# Altium schematic sheet OpenPLCv0.2.0_AnalogueOutput.SchDoc
size 420 x 297 mm; PageSetup: Record=PageOptions|CenterHorizontal=True|CenterVertical=True|PrintScale=1.01|XCorrection=1.00|YCorrection=1.00|PrintKind=1|BorderSize=5000000|LeftOffset=0|BottomOffset=0|Orientation=2|PaperLength=1000|PaperWidth=1000|Scale=100|PaperSource=7|PrintQuality=-4|MediaType=1|DitherType=10|PaperKind=A3|PrintScaleMode=1; DocumentNumber: 4; SheetNumber: 4; SheetTotal: 22; SheetTitle: Analogue Output
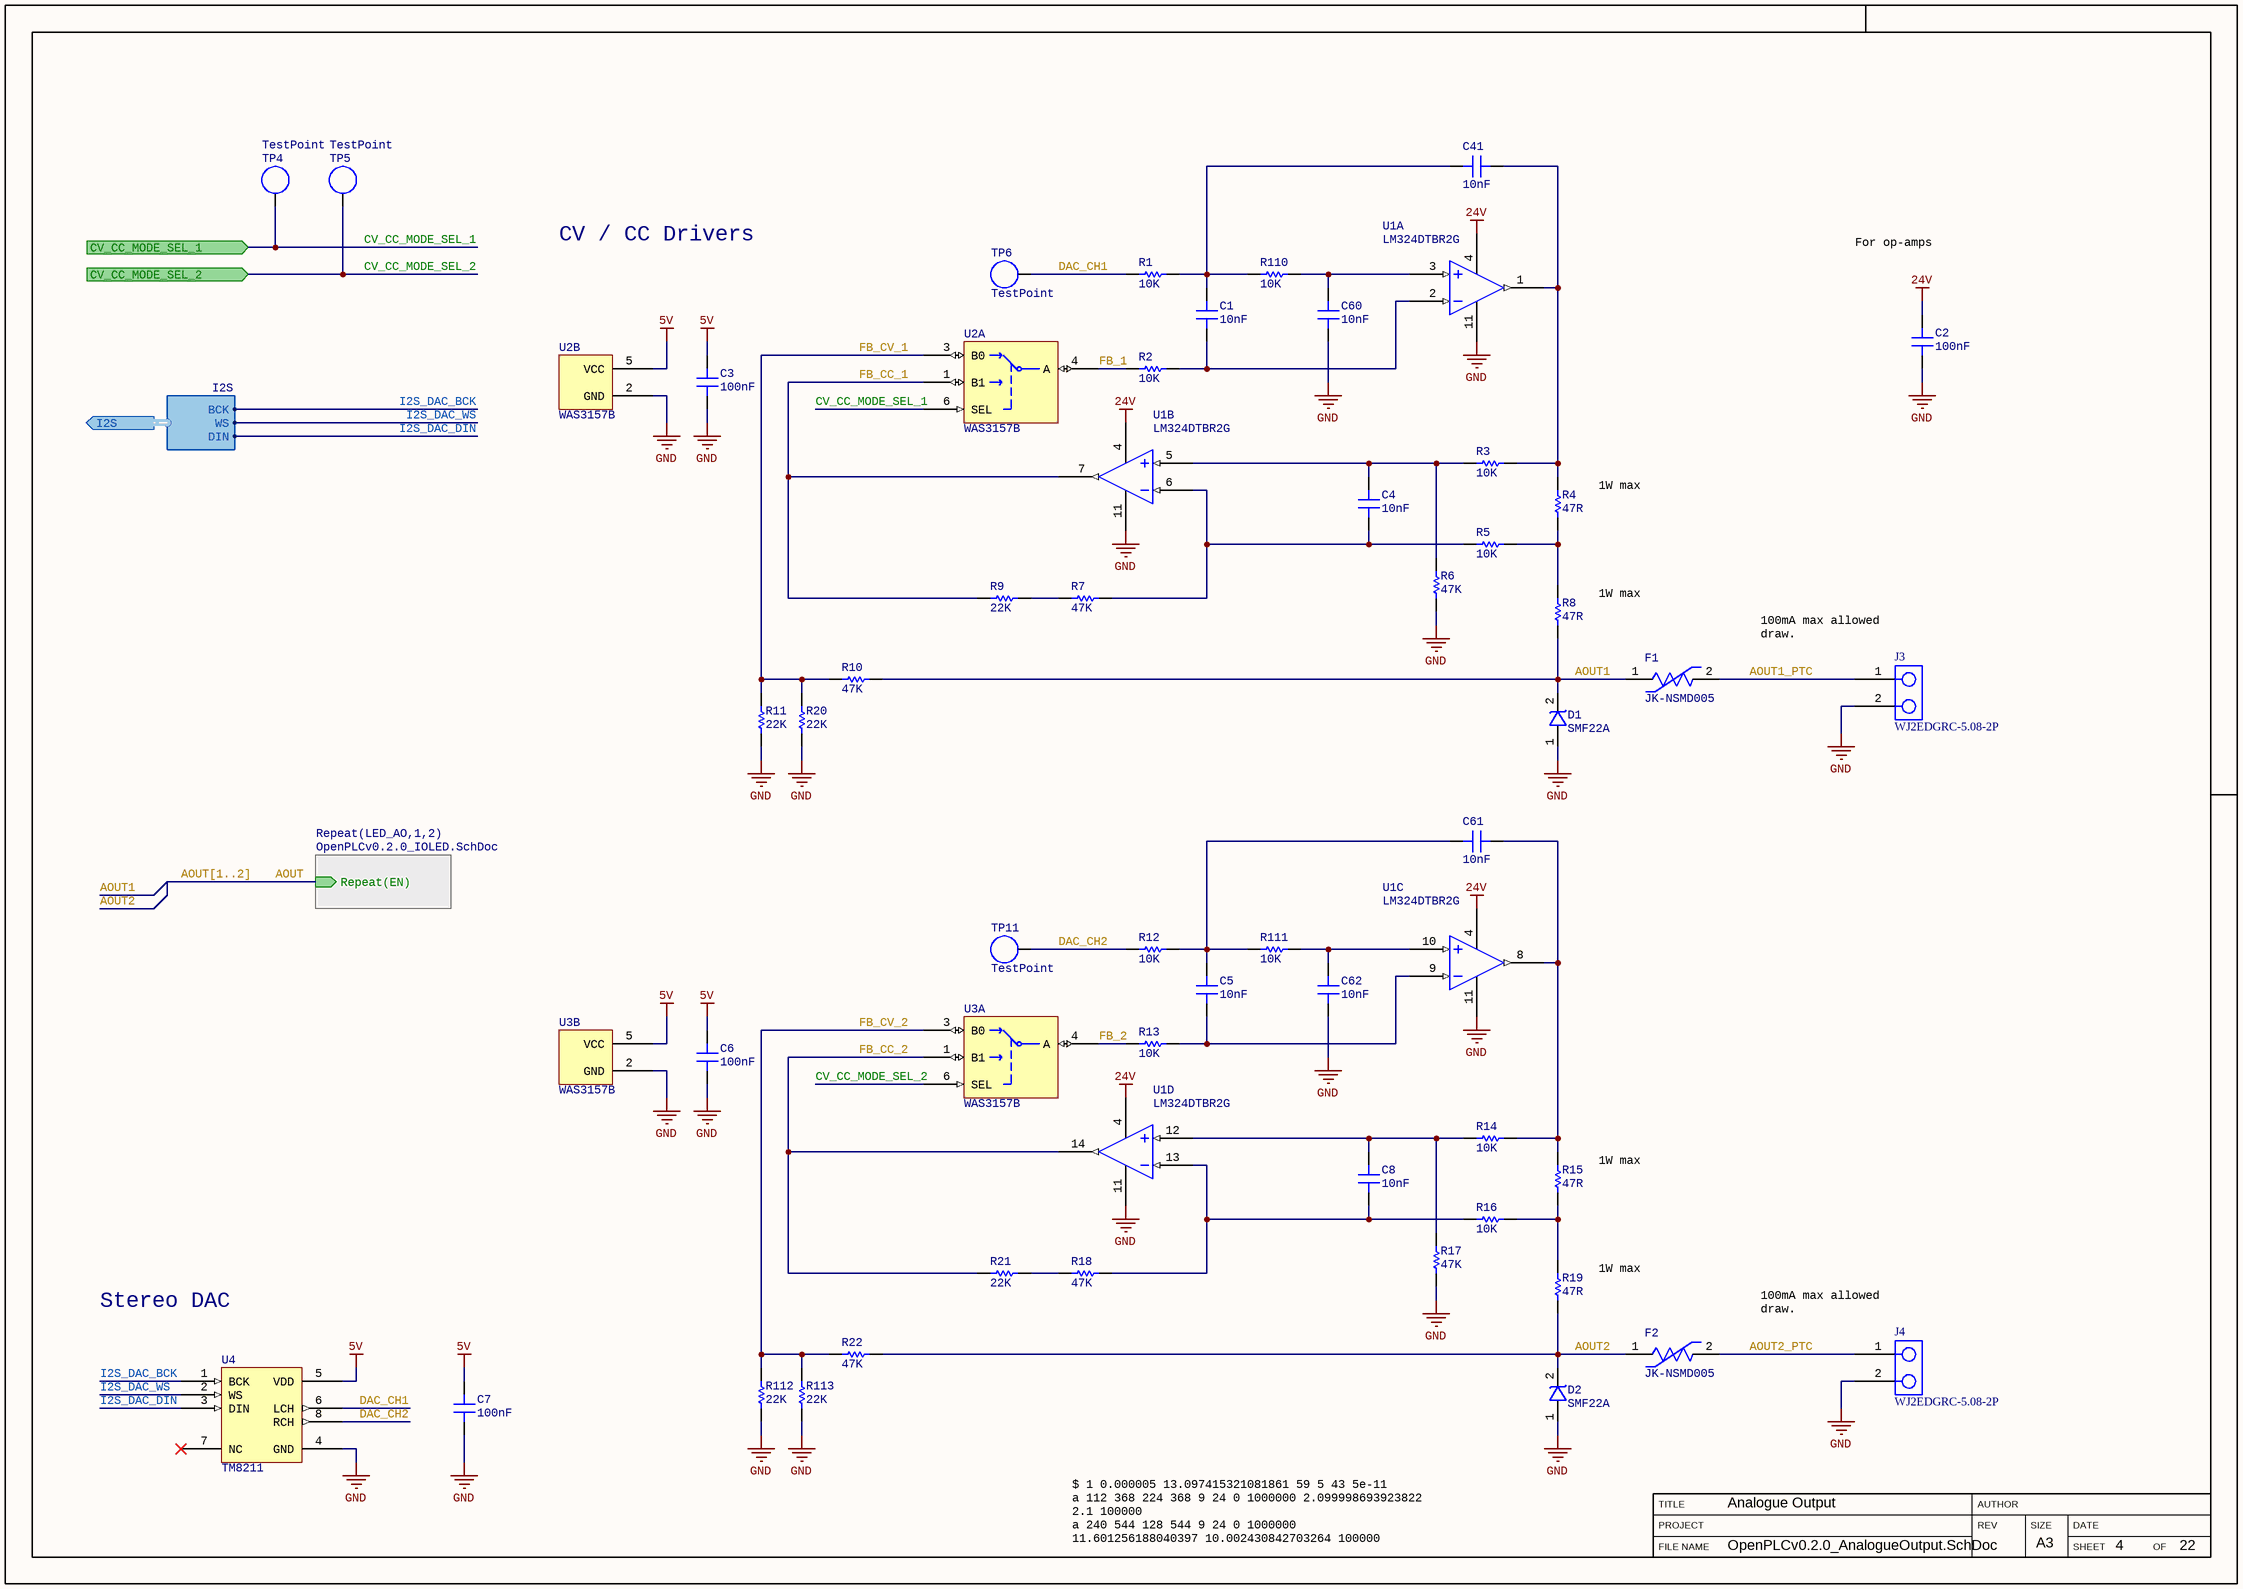
[diagram p0: OpenPLCv0.2.0_AnalogueOutput.SchDoc]

## Parts
C1  Capacitance: 10nF  [SMD_CAP_0402(1005)_N]  (hidden comment: CC0402KRX7R9BB103)
C2  Capacitance: 100nF  [SMD_CAP_0402(1005)_N]  (hidden comment: CC0402KRX5R9BB104)
C3  Capacitance: 100nF  [SMD_CAP_0402(1005)_N]  (hidden comment: CC0402KRX5R6BB104)
C4  Capacitance: 10nF  [SMD_CAP_0402(1005)_N]  (hidden comment: CC0402KRX7R9BB103)
C5  Capacitance: 10nF  [SMD_CAP_0402(1005)_N]  (hidden comment: CC0402KRX7R9BB103)
C6  Capacitance: 100nF  [SMD_CAP_0402(1005)_N]  (hidden comment: CC0402KRX5R6BB104)
C7  Capacitance: 100nF  [SMD_CAP_0402(1005)_N]  (hidden comment: CC0402KRX5R6BB104)
C8  Capacitance: 10nF  [SMD_CAP_0402(1005)_N]  (hidden comment: CC0402KRX7R9BB103)
C41  Capacitance: 10nF  [SMD_CAP_0402(1005)_N]  (hidden comment: CC0402KRX7R9BB103)
C60  Capacitance: 10nF  [SMD_CAP_0402(1005)_N]  (hidden comment: CC0402KRX7R9BB103)
C61  Capacitance: 10nF  [SMD_CAP_0402(1005)_N]  (hidden comment: CC0402KRX7R9BB103)
C62  Capacitance: 10nF  [SMD_CAP_0402(1005)_N]  (hidden comment: CC0402KRX7R9BB103)
D1  SMF22A  [SOD-123FL]
D2  SMF22A  [SOD-123FL]
F1  JK-NSMD005  [SMD_RES_1206(3216)_N]
F2  JK-NSMD005  [SMD_RES_1206(3216)_N]
J3  WJ2EDGRC-5.08-2P  [796638-2_BoardEdgeAlt]
J4  WJ2EDGRC-5.08-2P  [796638-2_BoardEdgeAlt]
R1  Resistance: 10K  [SMD_RES_0402(1005)_N]  (hidden comment: RC0402FR-0710KL)
R2  Resistance: 10K  [SMD_RES_0402(1005)_N]  (hidden comment: RC0402FR-0710KL)
R3  Resistance: 10K  [SMD_RES_0402(1005)_N]  (hidden comment: RC0402FR-0710KL)
R4  Resistance: 47R  [SMD_RES_2512(6432)_N]  (hidden comment: AC2512FK-0747RL)
R5  Resistance: 10K  [SMD_RES_0402(1005)_N]  (hidden comment: RC0402FR-0710KL)
R6  Resistance: 47K  [SMD_RES_0402(1005)_N]  (hidden comment: RC0402FR-0747KL)
R7  Resistance: 47K  [SMD_RES_0402(1005)_N]  (hidden comment: RC0402FR-0747KL)
R8  Resistance: 47R  [SMD_RES_2512(6432)_N]  (hidden comment: AC2512FK-0747RL)
R9  Resistance: 22K  [SMD_RES_0402(1005)_N]  (hidden comment: RC0402FR-0722KL)
R10  Resistance: 47K  [SMD_RES_0402(1005)_N]  (hidden comment: RC0402FR-0747KL)
R11  Resistance: 22K  [SMD_RES_0402(1005)_N]  (hidden comment: RC0402FR-0722KL)
R12  Resistance: 10K  [SMD_RES_0402(1005)_N]  (hidden comment: RC0402FR-0710KL)
R13  Resistance: 10K  [SMD_RES_0402(1005)_N]  (hidden comment: RC0402FR-0710KL)
R14  Resistance: 10K  [SMD_RES_0402(1005)_N]  (hidden comment: RC0402FR-0710KL)
R15  Resistance: 47R  [SMD_RES_2512(6432)_N]  (hidden comment: AC2512FK-0747RL)
R16  Resistance: 10K  [SMD_RES_0402(1005)_N]  (hidden comment: RC0402FR-0710KL)
R17  Resistance: 47K  [SMD_RES_0402(1005)_N]  (hidden comment: RC0402FR-0747KL)
R18  Resistance: 47K  [SMD_RES_0402(1005)_N]  (hidden comment: RC0402FR-0747KL)
R19  Resistance: 47R  [SMD_RES_2512(6432)_N]  (hidden comment: AC2512FK-0747RL)
R20  Resistance: 22K  [SMD_RES_0402(1005)_N]  (hidden comment: RC0402FR-0722KL)
R21  Resistance: 22K  [SMD_RES_0402(1005)_N]  (hidden comment: RC0402FR-0722KL)
R22  Resistance: 47K  [SMD_RES_0402(1005)_N]  (hidden comment: RC0402FR-0747KL)
R110  Resistance: 10K  [SMD_RES_0402(1005)_N]  (hidden comment: RC0402FR-0710KL)
R111  Resistance: 10K  [SMD_RES_0402(1005)_N]  (hidden comment: RC0402FR-0710KL)
R112  Resistance: 22K  [SMD_RES_0402(1005)_N]  (hidden comment: RC0402FR-0722KL)
R113  Resistance: 22K  [SMD_RES_0402(1005)_N]  (hidden comment: RC0402FR-0722KL)
TP4  TestPoint  [Pad]  (no BOM)
TP5  TestPoint  [Pad]  (no BOM)
TP6  TestPoint  [Pad]  (no BOM)
TP11  TestPoint  [Pad]  (no BOM)
U1  LM324DTBR2G  [TSSOP-14]  (parts A,B,C,D of 4)
U2  WAS3157B  [SOT23-6]  (parts A,B of 2)
U3  WAS3157B  [SOT23-6]  (parts A,B of 2)
U4  TM8211  [SOIC-8-3.9mm]

## Sub-sheets
Repeat(LED_AO,1,2) = OpenPLCv0.2.0_IOLED.SchDoc: Repeat(EN) (in)

## Ports
CV_CC_MODE_SEL_1 (in), CV_CC_MODE_SEL_2 (in), I2S (out, harness I2S)

## Harnesses
I2S: WS, BCK, DIN

## Nets
5V: C3.2 C6.2 C7.2 U2.5(VCC) U3.5(VCC) U4.5(VDD)
24V: C2.2 U1.4(VDD)
GND: C2.1 C3.1 C6.1 C7.1 C60.2 C62.2 D1.1(ANODE) D2.1(ANODE) J3.2 J4.2 R6.1 R11.1 R17.1 R20.1 R112.1 R113.1 U1.11(VSS) U2.2(GND) U3.2(GND) U4.4(GND)
AOUT: sheet Repeat(LED_AO,1,2)/Repeat(EN)
AOUT1: D1.2(CATHODE) F1.1 R8.1 R10.2
AOUT1_PTC: F1.2 J3.1
AOUT2: D2.2(CATHODE) F2.1 R19.1 R22.2
AOUT2_PTC: F2.2 J4.1
CV_CC_MODE_SEL_1: TP4.1 U2.6(SEL) ; port CV_CC_MODE_SEL_1
CV_CC_MODE_SEL_2: TP5.1 U3.6(SEL) ; port CV_CC_MODE_SEL_2
DAC_CH1: R1.1 TP6.1 U4.6(LCH)
DAC_CH2: R12.1 TP11.1 U4.8(RCH)
FB_1: R2.1 U2.4(A)
FB_2: R13.1 U3.4(A)
FB_CC_1: R9.2 U1.7(VOUT) U2.1(B1)
FB_CC_2: R21.2 U1.14(VOUT) U3.1(B1)
FB_CV_1: R10.1 R11.2 R20.2 U2.3(B0)
FB_CV_2: R22.1 R112.2 R113.2 U3.3(B0)
I2S_DAC_BCK: U4.1(BCK) ; port I2S.BCK
I2S_DAC_DIN: U4.3(DIN) ; port I2S.DIN
I2S_DAC_WS: U4.2(WS) ; port I2S.WS
NetC1_1: C1.1 R2.2 U1.2(VIN-)
NetC1_2: C1.2 C41.2 R1.2 R110.1
NetC4_1: C4.1 R5.1 R7.2 U1.6(VIN-)
NetC4_2: C4.2 R3.1 R6.2 U1.5(VIN+)
NetC5_1: C5.1 R13.2 U1.9(VIN-)
NetC5_2: C5.2 C61.2 R12.2 R111.1
NetC8_1: C8.1 R16.1 R18.2 U1.13(VIN-)
NetC8_2: C8.2 R14.1 R17.2 U1.12(VIN+)
NetC41_1: C41.1 R3.2 R4.2 U1.1(VOUT)
NetC60_1: C60.1 R110.2 U1.3(VIN+)
NetC61_1: C61.1 R14.2 R15.2 U1.8(VOUT)
NetC62_1: C62.1 R111.2 U1.10(VIN+)
NetR4_1: R4.1 R5.2 R8.2
NetR7_1: R7.1 R9.1
NetR15_1: R15.1 R16.2 R19.2
NetR18_1: R18.1 R21.1

Not connected (* = marked no-connect by the designer): U4 7(NC)*

## Buses and harness runs
bus AOUT[1..2]

## Notes on the sheet
- CV / CC Drivers
- For op-amps
- (near R4) 1W max
- (near R8) 1W max
- (near J3) 100mA max allowed draw.
- (near R15) 1W max
- Stereo DAC
- (near R19) 1W max
- (near J4) 100mA max allowed draw.
- $ 1 0.000005 13.097415321081861 59 5 43 5e-11
  a 112 368 224 368 9 24 0 1000000 2.099998693923822 2.1 100000
  a 240 544 128 544 9 24 0 1000000 11.601256188040397 10.002430842703264 100000
  r 112 384 -80 384 0 10000
  w 112 352 -144 352 0
  R -144 352 -144 304 0 0 40 2.1 0 0 0.5
  w -80 544 128 544 0
  w 32 544 32 624 0
  r 144 624 256 624 0 47000
  w 256 624 256 592 0
  w 240 528 288 528 0
  w 240 560 256 560 0
  w 256 560 256 592 0
  w 256 592 320 592 0
  w 288 528 320 528 0
  r 320 528 464 528 0 10000
  r 320 592 464 592 0 10000
  r 464 592 464 528 0 47
  r 464 592 464 736 0 47
  w -128 384 -80 384 0
  w 224 368 464 368 0
  w 464 368 464 528 0
  368 464 736 528 736 0 0
  r 464 848 464 944 0 1000
  g 464 944 464 960 0 0
  w 464 736 -32 736 0
  w 288 528 288 608 0
  r 288 608 288 672 0 47000
  g 288 672 288 688 0 0
  r -80 544 -80 448 0 1
  370 464 736 464 848 1 0 0
  s -80 384 -80 448 0 1 false
  s -128 384 -128 448 0 0 false
  368 -128 384 -192 384 0 0
  r -128 864 -128 928 0 11000
  g -128 928 -128 960 0 0
  r -128 736 -128 864 0 1
  368 -80 544 -80 592 0 0
  r -128 448 -128 544 0 1
  w -128 544 -128 736 0
  368 464 368 528 368 0 0
  368 -128 864 -192 864 0 0
  r -32 736 -128 736 0 47000
  r 144 624 32 624 0 22000
  o 24 64 0 4099 20 0.0001953125 0 2 24 3
  38 4 F1 0 0 5 -1 Voltage
  38 22 F1 0 1 1000 -1 Resistance
- FILE NAME
- PROJECT
- TITLE
- REV
- AUTHOR
- SIZE
- SHEET
- DATE
- OF
- A3

## Library data of the parts
C1 C4 C5 C8 C41 C60-C62 = 10nF 0402 50V 10%: 10nF ±10% 50V X7R 0402 Multilayer Ceramic Capacitors MLCC - SMD/SMT RoHS; Package: 0402; Tolerance: 10%; Voltage Rating: 50V
C2 = 100nF 0402 50V 10%: 100nF ±10% 50V X5R 0402 Multilayer Ceramic Capacitors MLCC - SMD/SMT RoHS; Package: 0402; Tolerance: 10%; Voltage Rating: 50V
C3 C6 C7 = 100nF 0402 10V 10%: 100nF ±10% 10V X5R 0402 Multilayer Ceramic Capacitors MLCC - SMD/SMT RoHS; Package: 0402; Tolerance: 10%; Voltage Rating: 10V
D1 D2 = SMF22A: Unidirectional 22V 24.4V 35.5V 5.6A SOD-123F TVS RoHS
F1 F2 = JK-NSMD005: 60V 150mA 1.5s 1206 PTC Resettable Fuses RoHS
J3 J4 = WJ2EDGRC-5.08-2P: Covered（4Sided） 2 1 0.200"（5.08mm） 2 P=5.08mm Pluggable System Terminal Block RoHS
R1-R3 R5 R12-R14 R16 R110 R111 = 10K 0402 1% 1/16W: 10kΩ ±1% 1/16W ±100ppm/℃ 0402 Chip Resistor - Surface Mount RoHS; Package: 0402; Tolerance: 1%; Power Rating: 1/16W
R4 R8 R15 R19 = 47R 2512 1% 1W: 47Ω ±1% 1W ±100ppm/℃ 2512 Chip Resistor - Surface Mount RoHS; Package: 2512; Tolerance: 1%; Power Rating: 1W
R6 R7 R10 R17 R18 R22 = 47K 0402 1% 1/16W: 47kΩ ±1% 1/16W ±100ppm/℃ 0402 Chip Resistor - Surface Mount RoHS; Package: 0402; Tolerance: 1%; Power Rating: 1/16W
R9 R11 R20 R21 R112 R113 = 22K 0402 1% 1/16W: 22kΩ ±1% 1/16W ±100ppm/℃ 0402 Chip Resistor - Surface Mount RoHS; Package: 0402; Tolerance: 1%; Power Rating: 1/16W
TP4-TP6 TP11 = Test point
U1 = LM324DTBR2G: General Purpose 4 3V ~ 32V, ±1.5V ~ 16V 1MHz 0.6 V/us TSSOP-14 Operational Amplifiers RoHS
U2 U3 = WAS3157B: 5.5Ω, 400MHz Bandwidth, SPDT Analog Switch SOT23-6
U4 = TM8211: Digital To Analog Converters (DACs) 16bit I2S